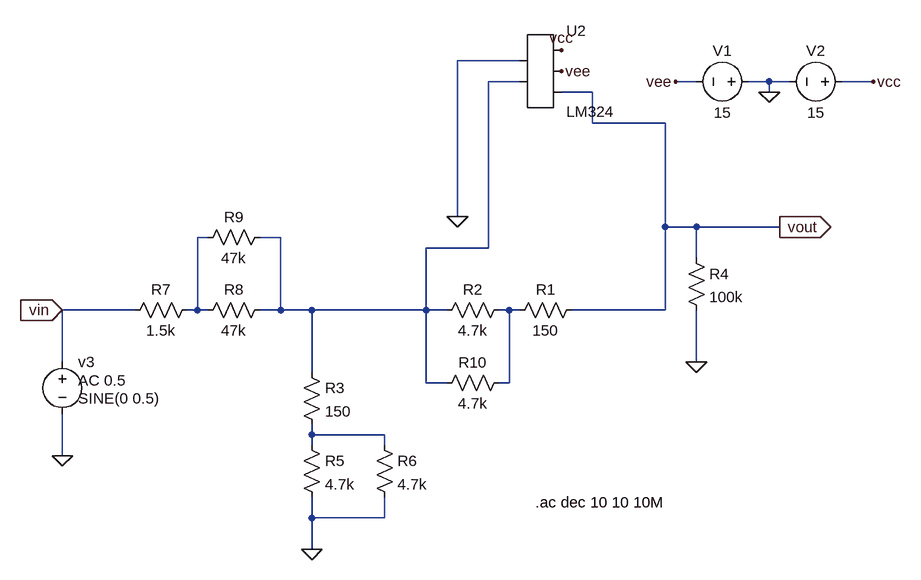
[diagram p0: schematic ej1_circ2_caso3.asc]
ej1_circ2_caso3.asc, the LTspice schematic file:
Version 4
SHEET 1 880 680
WIRE 160 -96 64 -96
WIRE 160 -64 112 -64
WIRE 432 -64 400 -64
WIRE 544 -64 512 -64
WIRE 576 -64 544 -64
WIRE 704 -64 656 -64
WIRE 272 -48 224 -48
WIRE 544 -48 544 -64
WIRE 272 0 272 -48
WIRE 384 0 272 0
WIRE 64 144 64 -96
WIRE 384 160 384 0
WIRE 432 160 384 160
WIRE 560 160 432 160
WIRE -320 176 -336 176
WIRE -208 176 -240 176
WIRE 112 192 112 -64
WIRE 112 192 16 192
WIRE 432 208 432 160
WIRE -432 288 -544 288
WIRE -336 288 -336 176
WIRE -336 288 -352 288
WIRE -320 288 -336 288
WIRE -208 288 -208 176
WIRE -208 288 -240 288
WIRE -160 288 -208 288
WIRE 16 288 16 192
WIRE 16 288 -160 288
WIRE 48 288 16 288
WIRE 144 288 128 288
WIRE 160 288 144 288
WIRE 384 288 384 160
WIRE 384 288 240 288
WIRE -544 368 -544 288
WIRE 432 368 432 288
WIRE -160 384 -160 288
WIRE 16 400 16 288
WIRE 48 400 16 400
WIRE 144 400 144 288
WIRE 144 400 128 400
WIRE -160 480 -160 464
WIRE -48 480 -160 480
WIRE -160 496 -160 480
WIRE -48 496 -48 480
WIRE -544 512 -544 448
WIRE -160 608 -160 576
WIRE -48 608 -48 576
WIRE -48 608 -160 608
WIRE -160 656 -160 608
FLAG 64 144 0
FLAG 432 368 0
FLAG 560 160 vout
IOPIN 560 160 Out
FLAG 544 -48 0
FLAG 400 -64 vee
FLAG 704 -64 vcc
FLAG -160 656 0
FLAG -544 288 vin
IOPIN -544 288 In
FLAG -544 512 0
FLAG 224 -112 vcc
FLAG 224 -80 vee
SYMBOL res -176 368 R0
SYMATTR InstName R3
SYMATTR Value 150
SYMBOL res 416 192 R0
SYMATTR InstName R4
SYMATTR Value 100k
SYMBOL voltage 528 -64 R90
WINDOW 0 -32 56 VBottom 2
WINDOW 3 32 56 VTop 2
WINDOW 123 0 0 Left 2
WINDOW 39 0 0 Left 2
SYMATTR InstName V1
SYMATTR Value 15
SYMBOL voltage 672 -64 R90
WINDOW 0 -32 56 VBottom 2
WINDOW 3 32 56 VTop 2
WINDOW 123 0 0 Left 2
WINDOW 39 0 0 Left 2
SYMATTR InstName V2
SYMATTR Value 15
SYMBOL res -176 480 R0
SYMATTR InstName R5
SYMATTR Value 4.7k
SYMBOL res -64 480 R0
SYMATTR InstName R6
SYMATTR Value 4.7k
SYMBOL voltage -544 352 R0
WINDOW 123 24 44 Left 2
WINDOW 39 0 0 Left 2
WINDOW 3 24 72 Left 2
SYMATTR Value2 AC 0.5
SYMATTR InstName v3
SYMATTR Value SINE(0 0.5)
SYMBOL res -448 304 R270
WINDOW 0 32 56 VTop 2
WINDOW 3 0 56 VBottom 2
SYMATTR InstName R7
SYMATTR Value 1.5k
SYMBOL res -336 304 R270
WINDOW 0 32 56 VTop 2
WINDOW 3 0 56 VBottom 2
SYMATTR InstName R8
SYMATTR Value 47k
SYMBOL res -336 192 R270
WINDOW 0 32 56 VTop 2
WINDOW 3 0 56 VBottom 2
SYMATTR InstName R9
SYMATTR Value 47k
SYMBOL res 256 272 R90
WINDOW 0 0 56 VBottom 2
WINDOW 3 32 56 VTop 2
SYMATTR InstName R1
SYMATTR Value 150
SYMBOL res 144 272 R90
WINDOW 0 0 56 VBottom 2
WINDOW 3 32 56 VTop 2
SYMATTR InstName R2
SYMATTR Value 4.7k
SYMBOL res 144 384 R90
WINDOW 0 0 56 VBottom 2
WINDOW 3 32 56 VTop 2
SYMATTR InstName R10
SYMATTR Value 4.7k
SYMBOL AutoGenerated\\LM324 192 -80 R0
SYMATTR InstName U2
TEXT 184 584 Left 2 !.ac dec 10 10 10M

The netlist it stands for:
* ej1_circ2_caso3.asc
R3 N001 N004 150
R4 vout 0 100k
V1 0 vee 15
V2 vcc 0 15
R5 N004 0 4.7k
R6 N004 0 4.7k
v3 vin 0 SINE(0 0.5) AC 0.5
R7 vin N002 1.5k
R8 N002 N001 47k
R9 N002 N001 47k
R1 vout N003 150
R2 N003 N001 4.7k
R10 N003 N001 4.7k
* U2: LM324 (symbol AutoGenerated\LM324 not available, pins judged from their places): pin1=0 pin2=N001 pin3=vcc pin4=vee pin5=vout
.ac dec 10 10 10M
.backanno
.end